# EAGLE design twinklr_board (EAGLE 7.5.0)
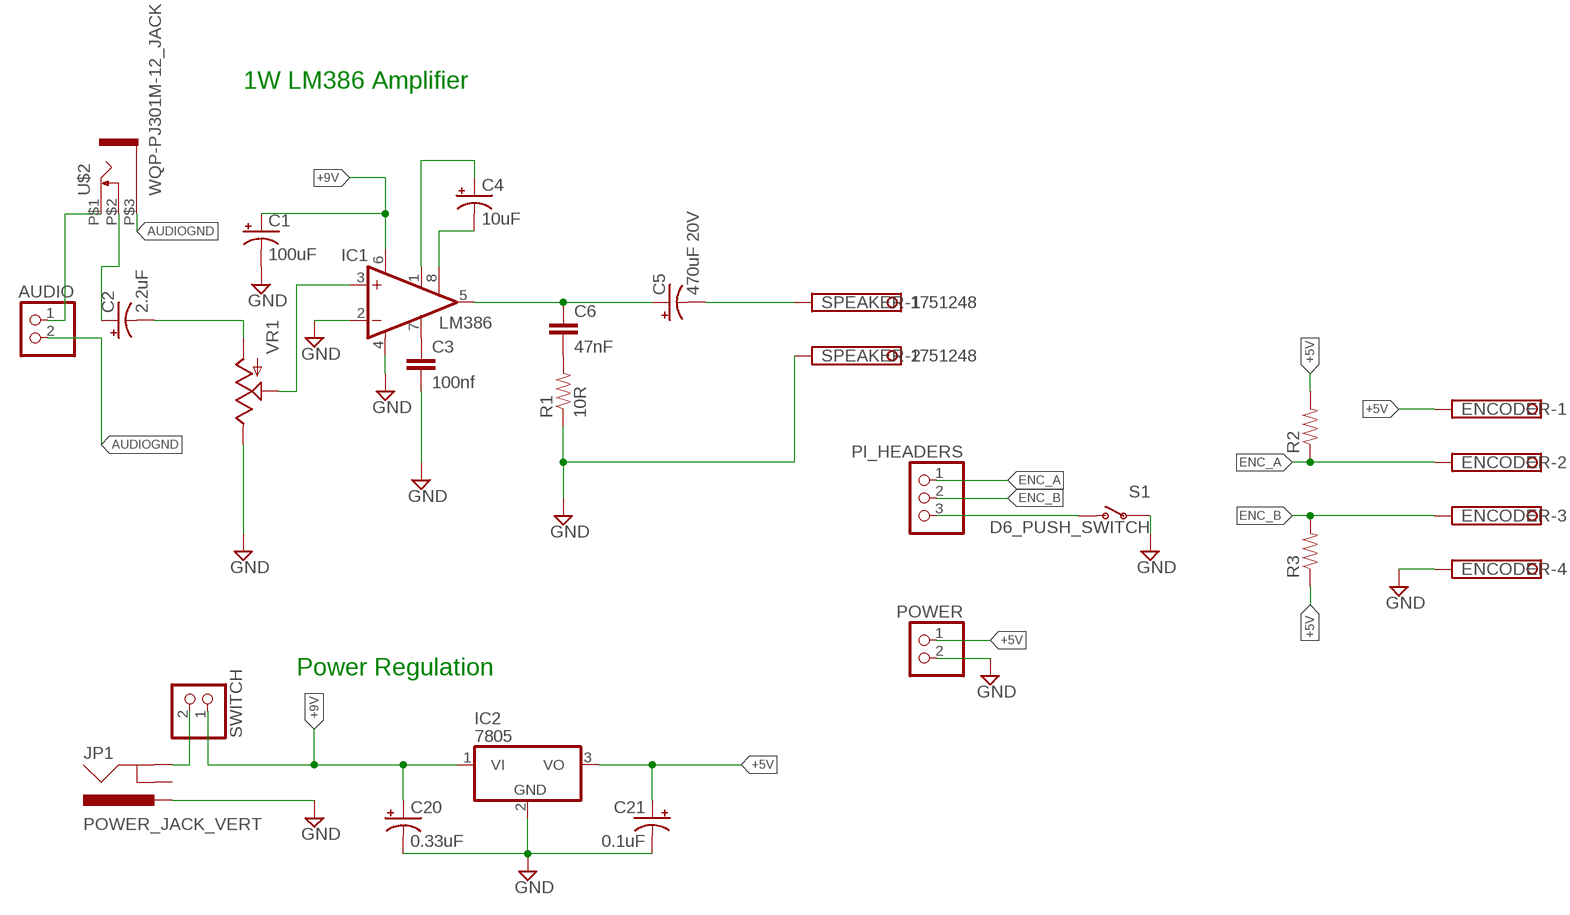
[diagram p0: schematic, sheet 1]

## Parts
AUDIO  PINHD-1X2  [1X02]
C1  100uF  CAP_POLPTH2  [CPOL-RADIAL-10UF-25V]
C2  2.2uF  CAP_POLPTH2  [CPOL-RADIAL-10UF-25V]
C3  100nf  CAPPTH  [CAP-PTH-SMALL]
C4  10uF  CAP_POLPTH2  [CPOL-RADIAL-10UF-25V]
C5  470uF 20V  CAP_POLPTH4  [CPOL-RADIAL-1000UF-25V]
C6  47nF  CAP_  [AXIAL-5MM]
C20  0.33uF  CAP_POLPTH2  [CPOL-RADIAL-10UF-25V]
C21  0.1uF  CAP_POLPTH2  [CPOL-RADIAL-10UF-25V]
ENCODER  1751264  [1751264]
IC1  LM386  LM386N-1  [DIL08]
IC2  7805  7805TV  [TO220V]
JP1  POWER_JACK_VERT  [POWER_JACK_VERT]
PI_HEADERS  PINHD-1X3  [1X03]
POWER  PINHD-1X2  [1X02]
R1  10R  RESISTORAXIAL-0.3  [AXIAL-0.3]
R2  RESISTORAXIAL-0.3  [AXIAL-0.3]
R3  RESISTORAXIAL-0.3  [AXIAL-0.3]
S1  D6_PUSH_SWITCH  [D6_PUSH_SWITCH]
SPEAKER  1751248  [1751248]
SWITCH  PINHD-1X2  [1X02]
U$2  WQP-PJ301M-12_JACK  [WQP-PJ301M-12_JACK]
VR1  POT  [ALPS_POT]

## Nets
+5V: C21.1(+) ENCODER.1 IC2.3(VO) POWER.1 R2.P$2 R3.P$1
+9V: C1.1(+) C20.1(+) IC1.6(VS) IC2.1(VI) SWITCH.1
AUDIOGND: AUDIO.2 U$2.P$3
ENC_A: ENCODER.2 PI_HEADERS.1 R2.P$1
ENC_B: ENCODER.3 PI_HEADERS.2 R3.P$2
GND: C1.2(-) C3.2 C20.2(-) C21.2(-) ENCODER.4 IC1.2(-IN) IC1.4(GND) IC2.2(GND) JP1.PWR POWER.2 R1.P$1 S1.P$3(P) S1.P$4(P) SPEAKER.2 VR1.P$1(E)
N$1: AUDIO.1 U$2.P$1
N$2: C2.2(-) VR1.P$3(A)
N$3: IC1.3(+IN) VR1.P$2(S)
N$4: C4.1(+) IC1.1(GAIN)
N$5: C4.2(-) IC1.8(GAIN)
N$6: C5.+ C6.P$1 IC1.5(OUT)
N$7: C2.1(+) U$2.P$2
N$8: C6.P$2 R1.P$2
N$9: C5.- SPEAKER.1
N$10: C3.1 IC1.7(BYPASS)
N$11: JP1.GND SWITCH.2
N$13: PI_HEADERS.3 S1.P$1(O) S1.P$2(O)
Unconnected: JP1.GNDBREAK

## Notes on the sheet
- 1W LM386 Amplifier
- Power Regulation

## Library data of the parts
AUDIO POWER SWITCH = pinhead:PINHD-1X2: PIN HEADER
C1 C2 C4 C5 C20 C21 = SparkFun-Capacitors:CAP_POL: Capacitor Polarized These are standard SMD and PTH capacitors. Normally 10uF, 47uF, and 100uF in electrolytic and tantalum varieties. Always verify the external diameter of the through hole cap, it varies with capacity, voltage, and manufacturer. The EIA devices should be standard.
C3 C6 = SparkFun-Capacitors:CAP: Capacitor Standard 0603 ceramic capacitor, and 0.1" leaded capacitor.
ENCODER = con-phoenix-350:1751264: MKDS 1/ 4-3,5 Printklemme Nennstrom: 10 A Bemessungsspannung: 160 V Raster: 3,5 mm Polzahl: 4 Montageart: Löten Anschlussart: Schraubanschluss Anschlussrichtung vom Leiter zur Platine: 0° Source: http://eshop.phoenixcontact.com .. 1751264.pdf; MPN: 1751264; OC_FARNELL: unknown; OC_NEWARK: 10R0934
IC1 = linear:LM386?-*: Low Voltage Audio Power Amplifier Source: http://cache.national.com/ds/LM/LM386.pdf
IC2 = linear:78*: Positive VOLTAGE REGULATOR Source: http://cache.national.com/ds/LM/LM78L05.pdf http://www.fairchildsemi.com/ds/LM/LM7805.pdf
JP1 = foxfield:POWER_JACK_VERT: Power Jack This is the standard 5.5mm barrel jack for power. The PTH is the most common, proven, reliable, footprint. The Slot footprint only works if the mill layer is transmitted to the PCB fab house so be warned. Mating wall wart : TOL-00298 (and others)
PI_HEADERS = adafruit:PINHD-1X3: PIN HEADER
R1-R3 = SparkFun-Resistors:RESISTOR: Resistor Basic schematic elements and footprints for 0603, 1206, and PTH resistors.
S1 = MusicThingModular:D6_PUSH_SWITCH: Push switch
SPEAKER = con-phoenix-350:1751248: MKDS 1/ 2-3,5 Printklemme Nennstrom: 10 A Bemessungsspannung: 160 V Raster: 3,5 mm Polzahl: 2 Montageart: Löten Anschlussart: Schraubanschluss Anschlussrichtung vom Leiter zur Platine: 0° Source: http://eshop.phoenixcontact.com .. 1751248.pdf; OC_FARNELL: unknown; OC_NEWARK: unknown
U$2 = thonkiconn:WQP-PJ301M-12_JACK
VR1 = SparkFun-Electromechanical:POT; PROD_ID: RES-09177

## Board
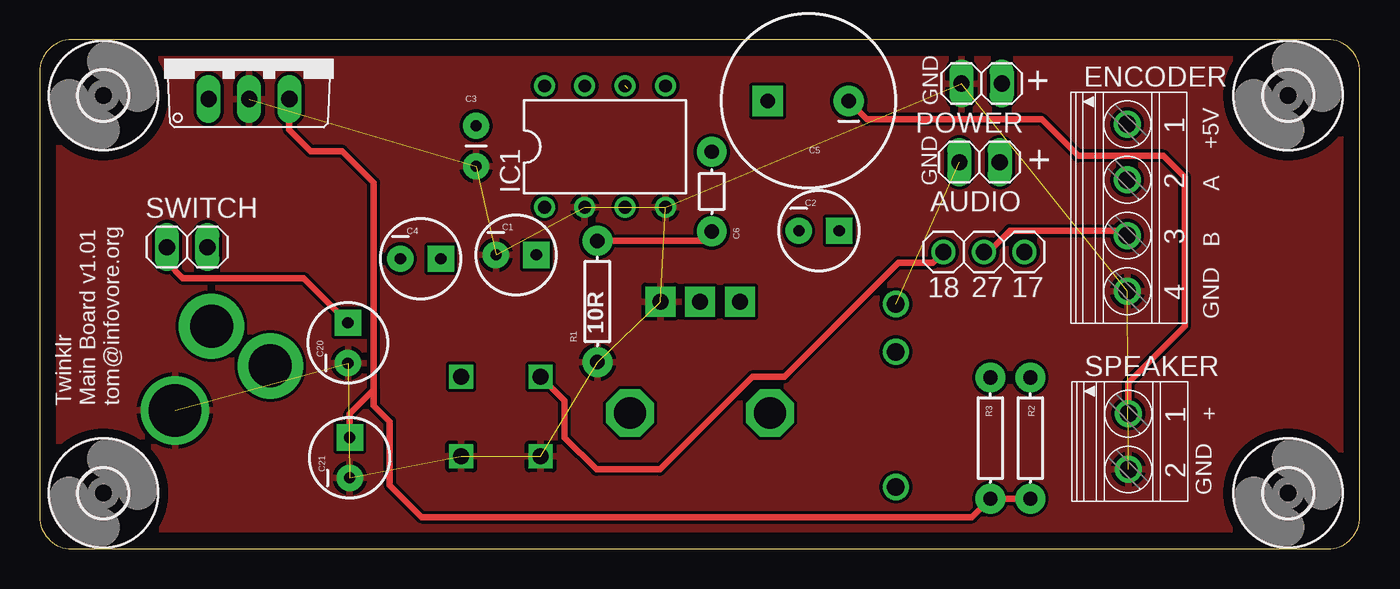
[diagram p1: board, top side]
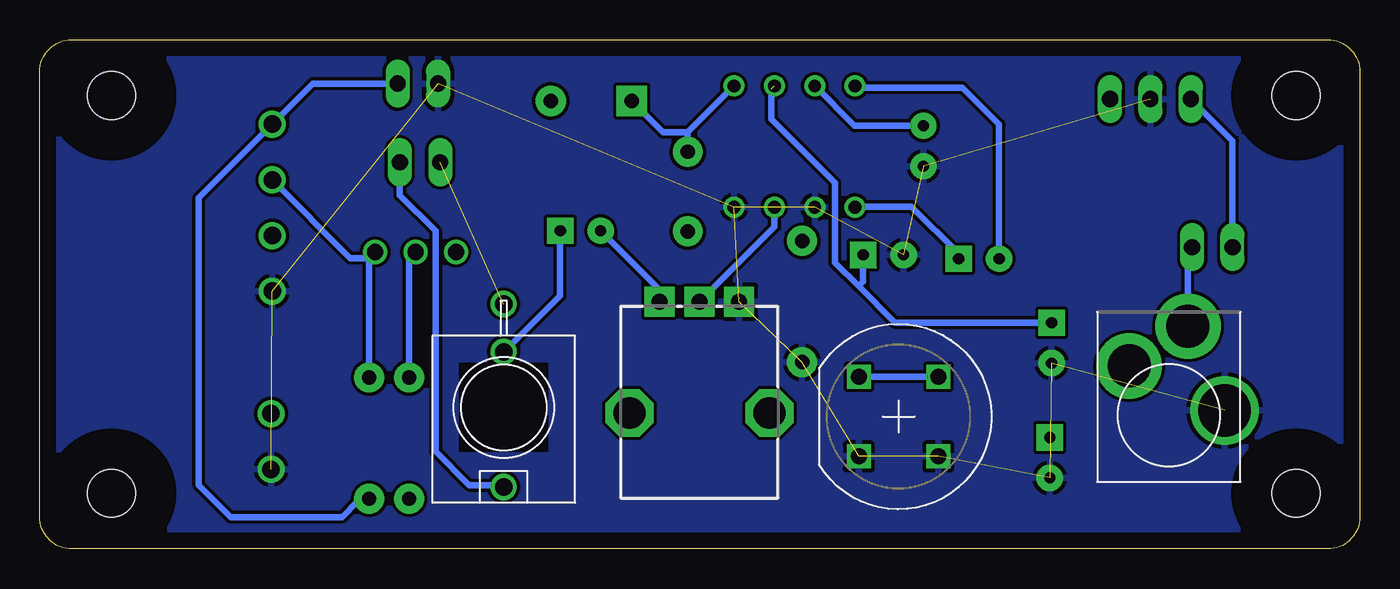
[diagram p2: board, bottom side, seen from below]

Size 83 x 32 mm. Coordinates in mm from the lower left corner, seen from the top.
Outline: 0,30 0,2 arc90 2,0 81,0 arc90 83,2 83,30 arc90 81,32 2,32 arc90 0,30
Copper layers (1*16): Top 0.035mm / dielectric 1.5mm / Bottom 0.035mm
Design rules "default": minimum track width 10mil, minimum drill 24mil, track to track 8mil, track to pad 8mil, pad to pad 8mil, via to via 8mil, smd to smd 8mil, copper to edge 40mil, drill to drill 8mil, minimum pad ring 10mil, minimum via ring 8mil, stop-mask expansion 4mil, vias tented up to drill 0mil, thermal gap 10mil

### Footprints (pad centres in the part's own frame; a part is rotated, then mirrored left to right if it is on the bottom)
1X02 = drill 1.016 long: 1 -1.27,0; 2 1.27,0
CPOL-RADIAL-10UF-25V = drill 0.7 pad 1.651 square: 1 1.27,0 | drill 0.7 pad 1.651: 2 -1.27,0
CAP-PTH-SMALL = drill 0.7 pad 1.651: 1 0,0; 2 2.54,0
CPOL-RADIAL-1000UF-25V = drill 0.9 pad 1.93 square: + 2.54,0 | drill 0.9 pad 1.93: - -2.54,0
AXIAL-5MM = drill 0.9 pad 1.88: P$1 -2.5,0; P$2 2.5,0
1751264 = drill 1.1 pad 1.7: 1 -5.25,-0.1; 2 -1.75,-0.1; 3 1.75,-0.1; 4 5.25,-0.1
DIL08 = drill 0.813 pad 1.27: 1 -3.81,-3.81; 2 -1.27,-3.81; 3 1.27,-3.81; 4 3.81,-3.81; 5 3.81,3.81; 6 1.27,3.81; 7 -1.27,3.81; 8 -3.81,3.81
TO220V = drill 1.016 long: 1 -2.54,-2.54; 2 0,-2.54; 3 2.54,-2.54
POWER_JACK_VERT = drill 2.7 pad 4.1: GND -1.2,1; GNDBREAK 2.5,3.5 | drill 3.3 pad 4.3: PWR -3.5,6.3
1X03 = drill 1.016: 1 -2.54,0; 2 0,0; 3 2.54,0
AXIAL-0.3 = drill 0.9 pad 1.88: P$1 -3.81,0; P$2 3.81,0
D6_PUSH_SWITCH = drill 1 square: P$1 -2.5,2.5; P$2 2.5,2.5; P$3 2.5,-2.5; P$4 -2.5,-2.5
1751248 = drill 1.1 pad 1.7: 1 -1.75,-0.1; 2 1.75,-0.1
3,0 = hole 3: 0,0
WQP-PJ301M-12_JACK = drill 1.1: P$1 0,5; P$2 0,-3.5; P$3 0,-6.5
ALPS_POT = drill 1 pad 1.88 square: P$1 7,-2.5; P$2 7,0; P$3 7,2.5 | drill 2 octagon: P$4 0,-4.4; P$5 0,4.4

### Placement (x,y rotation side)
AUDIO  59.09,24.31 180 top
C1  29.96,18.48 0 top
C2  49,20 0 top
C3  27.44,26.59 270 top
C4  23.95,18.23 0 top
C5  48.32,28.16 180 top
C6  42.26,22.46 270 top
C20  19.37,12.95 90 top
C21  19.49,5.73 90 top
ENCODER  68.49,21.44 270 top
IC1  35.54,25.29 0 top
IC2  13.16,30.81 0 top
JP1  12,15 180 bottom
PI_HEADERS  59.37,18.66 180 top
POWER  59.22,29.25 180 top
R1  35.06,15.55 90 top
R2  62.28,6.96 270 top
R3  59.77,6.96 90 top
S1  29,8.31 0 bottom
SPEAKER  68.55,6.75 270 top
SWITCH  9.27,18.97 0 top
U$1  [3,0]  78.5,28.5 0 top
U$2  53.83,8.89 180 bottom
U$3  [3,0]  4,28.5 0 top
U$4  [3,0]  78.5,3.5 0 top
U$5  [3,0]  4,3.5 0 top
VR1  41.52,8.54 90 bottom

### Tracks (layer width: path | path; a pad name or v marks a point on that pad's centre or on a via)
+5V
  Top 0.406: C21.1 19.49,8.49 21,10 | 21,10 21,23 19,25 17.02,25 15.68,26.34 15.68,28.26 IC2.3 | 21,10 21,9 22,8 22,4 24,2 58.62,2 R3.P$1 R2.P$2
  Bottom 0.406: POWER.1 65.83,29.25 ENCODER.1 73,22.08 73,4 71,2 64,2 62.97,3.03 R2.P$2
+9V  (1 unrouted)
  Top 0.406: SWITCH.1 8,18 9,17 16.59,17 C20.1
  Bottom 0.406: SWITCH.1 8,25.65 IC2.1 | C20.1 29.22,14.22 31.5,16.5 | 31.5,16.5 33,18 33,23 37,27 37,28.91 | C1.1 31.23,16.77 31.5,16.5
AUDIOGND  (1 unrouted)
ENC_A
  Bottom 0.406: R2.P$1 62.28,18.28 | 62.28,18.28 PI_HEADERS.1 | 62.28,18.28 63.47,18.28 ENCODER.2
ENC_B
  Top 0.406: PI_HEADERS.2 59.66,18.66 61,20 68.08,20 ENCODER.3
  Bottom 0.406: R3.P$2 59.77,18.25 PI_HEADERS.2
GND  (14 unrouted)
  pour Bottom: 2,32 81,32 arc-90 83,30 83,2 arc-90 81,0 2,0 arc-90 0,2 0,30 arc-90
  pour Top: 0,30 0,2 arc90 2,0 81,0 arc90 83,2 83,30 arc90 81,32 2,32 arc90
N$1
  Bottom 0.406: AUDIO.1 60.36,22.22 58.12,19.98 58.12,6.12 56,4 53.94,4 U$2.P$1
N$2
  Bottom 0.406: VR1.P$3 44.02,16.29 C2.2
N$3
  Bottom 0.406: IC1.3 36.81,20.25 VR1.P$2
N$4
  Bottom 0.406: C4.1 25.22,18.56 28.18,21.52 31.69,21.52 IC1.1
N$5
  Bottom 0.406: C4.2 22.68,26.68 25,29 31.64,29 IC1.8
N$6
  Bottom 0.406: C6.P$1 42.26,26.19 | 42.26,26.19 IC1.5 | 42.26,26.19 43.82,26.19 C5.+
N$7
  Bottom 0.406: U$2.P$2 53.8,12.39 50.27,15.91 C2.1
N$8
  Top 0.406: R1.P$2 41.66,19.36 C6.P$2
N$9
  Top 0.406: SPEAKER.1 68.45,10.45 72,14 72,23.37 70.66,24.7 65.3,24.7 63,27 52.02,27 C5.-
N$10
  Bottom 0.406: C3.1 31.77,26.59 IC1.7
N$11
  Bottom 0.406: JP1.GND 10.8,18.71 SWITCH.2
N$13
  Top 0.406: PI_HEADERS.3 56.17,18 54,18 46.81,10.81 44.81,10.81 39,5 35,5 33,7 33,9.31 S1.P$1
  Bottom 0.406: S1.P$2 S1.P$1

### Text on the board
tNames: GND | + | +5V | GND | + | A | B | 18 | 27 | 17 | GND | Twinklr / Main Board v1.01 / tom@infovore.org | + | GND